# EAGLE design a22 (EAGLE 9.4.2)
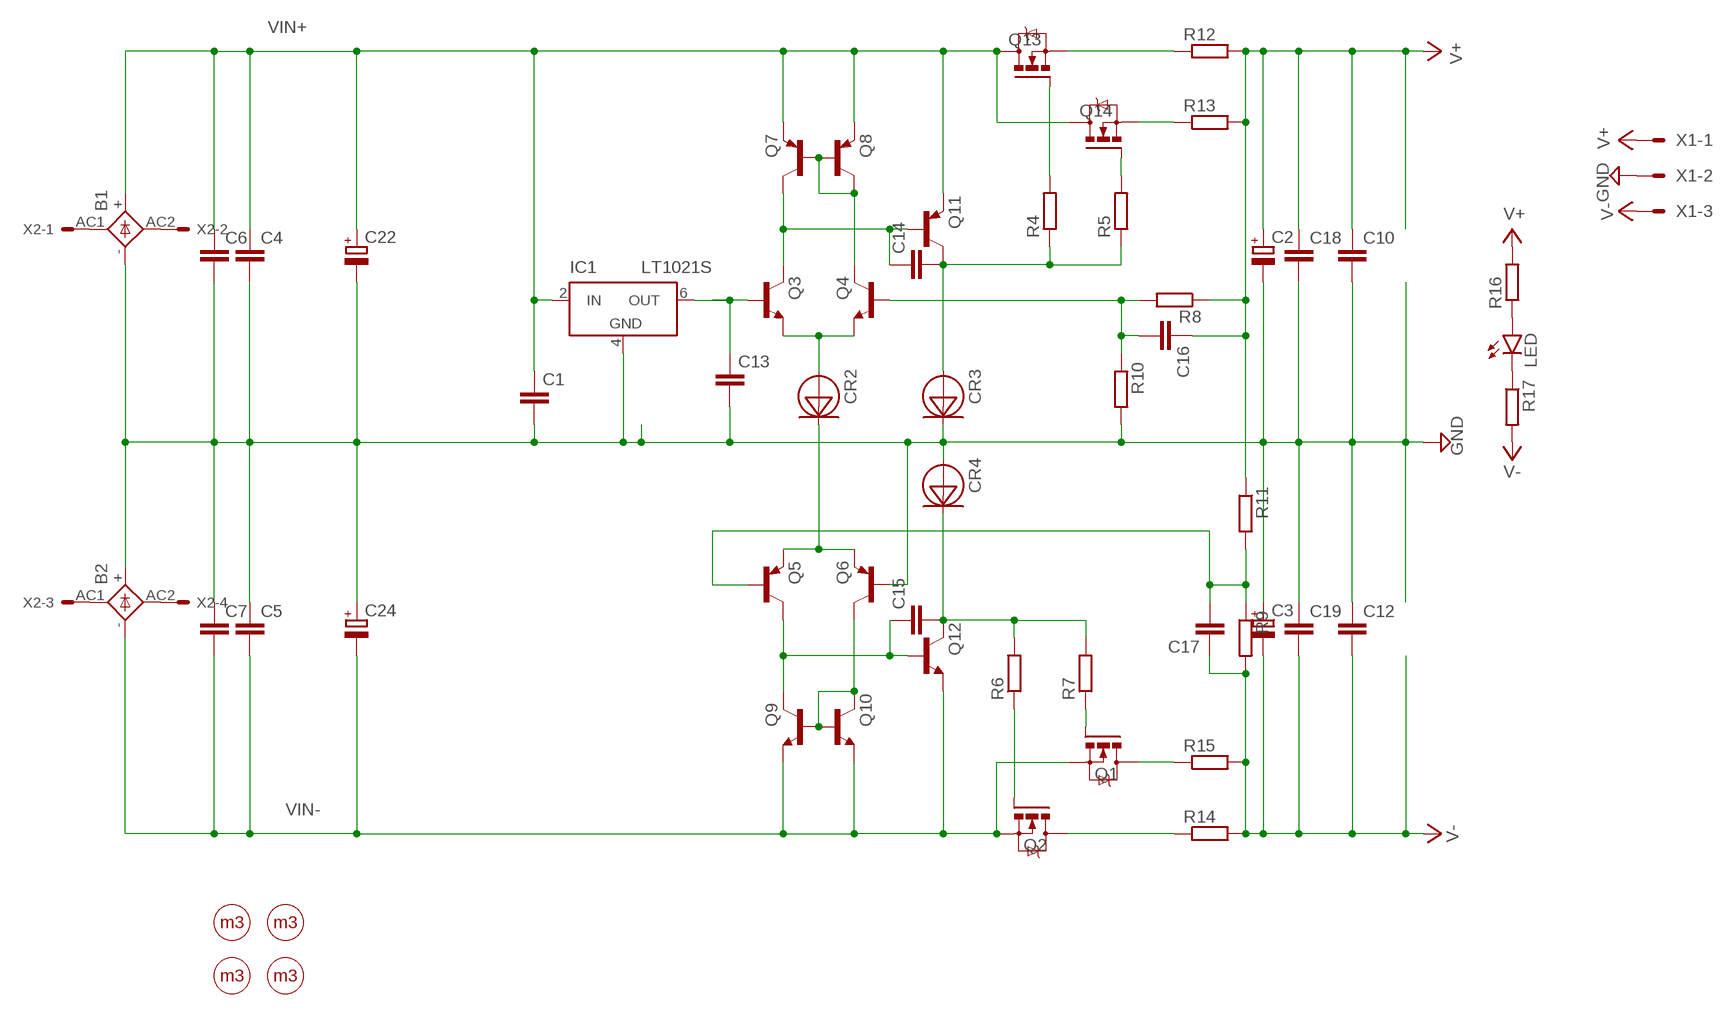
[diagram p0: schematic, sheet 1]

## Parts
B1  2KBB-R  [2KBB-R]
B2  2KBB-R  [2KBB-R]
C1  C-EUC0805  [C0805]
C2  CPOL-EUE5-13  [E5-13]
C3  CPOL-EUE5-13  [E5-13]
C4  C-EU050-050X075  [C050-050X075]
C5  C-EU050-050X075  [C050-050X075]
C6  C-EU050-050X075  [C050-050X075]
C7  C-EU050-050X075  [C050-050X075]
C10  C-EU050-050X075  [C050-050X075]
C12  C-EU050-050X075  [C050-050X075]
C13  C-EUC0805  [C0805]
C14  C-EUC0805  [C0805]
C15  C-EUC0805  [C0805]
C16  C-EUC0805  [C0805]
C17  C-EUC0805  [C0805]
C18  C-EU050-050X075  [C050-050X075]
C19  C-EU050-050X075  [C050-050X075]
C22  CPOL-EUE10-25  [EB25D]
C24  CPOL-EUE10-25  [EB25D]
CR2  1N5283  [SMD]
CR3  1N5283  [SMD]
CR4  1N5283  [SMD]
IC1  LT1021S  [SOIC8]
LED  LEDVWV1206  [LED_SML1206]
Q1  IRFZ24N  [TRANSISTOR_TO220KG]
Q2  IRFZ24N  [TRANSISTOR_TO220KG]
Q3  BJT_NPNKSC1845  [TRANSISTOR_TO92-ECB_N]
Q4  BJT_NPNKSC1845  [TRANSISTOR_TO92-ECB_N]
Q5  BJT_PNPKSA992  [TRANSISTOR_TO92-ECB_P]
Q6  BJT_PNPKSA992  [TRANSISTOR_TO92-ECB_P]
Q7  BJT_PNPKSA992  [TRANSISTOR_TO92-ECB_P]
Q8  BJT_PNPKSA992  [TRANSISTOR_TO92-ECB_P]
Q9  BJT_NPNKSC1845  [TRANSISTOR_TO92-ECB_N]
Q10  BJT_NPNKSC1845  [TRANSISTOR_TO92-ECB_N]
Q11  BJT_PNPKSA992  [TRANSISTOR_TO92-ECB_P]
Q12  BJT_NPNKSC1845  [TRANSISTOR_TO92-ECB_N]
Q13  IRFZ24N  [TRANSISTOR_TO220KG]
Q14  IRFZ24N  [TRANSISTOR_TO220KG]
R4  R-EU_MELF0204W  [MINI_MELF-0204W]
R5  R-EU_MELF0204W  [MINI_MELF-0204W]
R6  R-EU_MELF0204W  [MINI_MELF-0204W]
R7  R-EU_MELF0204W  [MINI_MELF-0204W]
R8  R-EU_MELF0204W  [MINI_MELF-0204W]
R9  R-EU_MELF0204W  [MINI_MELF-0204W]
R10  R-EU_MELF0204W  [MINI_MELF-0204W]
R11  R-EU_MELF0204W  [MINI_MELF-0204W]
R12  R-EU_R2512  [R2512]
R13  R-EU_R2512  [R2512]
R14  R-EU_R2512  [R2512]
R15  R-EU_R2512  [R2512]
R16  R-EU_MELF0204W  [MINI_MELF-0204W]
R17  R-EU_MELF0204W  [MINI_MELF-0204W]
U$1  HOLE  [M3_HOLE]
U$2  HOLE  [M3_HOLE]
U$3  HOLE  [M3_HOLE]
U$4  HOLE  [M3_HOLE]
X1  KK-156-3  [KK-156-3]
X2  KK-156-4  [KK-156-4]

## Nets
GND: B1.- B2.+ C1.2 C2.- C3.+ C4.2 C5.1 C6.2 C7.1 C10.2 C12.1 C13.2 C18.2 C19.1 C22.- C24.+ CR3.CATHODE CR4.ANODE IC1.4(GND) Q6.B R10.2 X1.2
N$1: B1.AC1 X2.1
N$2: B1.AC2 X2.2
N$3: Q1.1(G) R7.1
N$4: Q13.1(G) R4.2
N$5: C17.2 Q5.B R9.1 R11.2
N$6: B2.AC1 X2.3
N$7: B2.AC2 X2.4
N$10: LED.A R16.1
N$13: CR2.CATHODE Q5.E Q6.E
N$14: CR2.ANODE Q3.E Q4.E
N$15: C13.1 IC1.6(OUT) Q3.B
N$16: Q4.C Q7.B Q8.B Q8.C
N$17: Q6.C Q9.B Q10.B Q10.C
N$18: C15.1 Q5.C Q9.C Q12.B
N$21: C14.1 Q3.C Q7.C Q11.B
N$22: C14.2 CR3.ANODE Q11.C R4.1 R5.1
N$23: C15.2 CR4.CATHODE Q12.C R6.2 R7.2
N$24: Q14.1(G) R5.2
N$26: LED.C R17.1
N$27: Q2.1(G) R6.1
N$28: C16.2 Q4.B R8.2 R10.1
N$30: Q1.2(D) R15.1
N$31: Q2.2(D) R14.1
N$33: Q13.3(S) R12.1
N$34: Q14.3(S) R13.1
V+: C2.+ C10.1 C16.1 C18.1 R8.1 R11.1 R12.2 R13.2 R16.2 X1.1
V-: C3.- C12.2 C17.1 C19.2 R9.2 R14.2 R15.2 R17.2 X1.3
VIN+: B1.+ C1.1 C4.1 C6.1 C22.+ IC1.2(IN) Q7.E Q8.E Q11.E Q13.2(D) Q14.2(D)
VIN-: B2.- C5.2 C7.2 C24.- Q1.3(S) Q2.3(S) Q9.E Q10.E Q12.E

## Library data of the parts
B1 B2 = rectifier:2KBB-R: RECTIFIER grid 3 x 5 mm
C1 C4-C7 C10 C12-C19 = Vwvwbg:C-EU: CAPACITOR, European symbol
C2 C3 C22 C24 = Vwvwbg:CPOL-EU: POLARIZED CAPACITOR, European symbol
CR2-CR4 = crd:1N5283: 0.22 mA through 4.23 mA current regulating diode series
IC1 = Vwvwbg:LT1021: Precision Reference Source: http://www.linear.com/pc/downloadDocument.do?navId=H0,C1,C1010,C1603,P1229,D2805; MPN: LT1021DCS8-10#PBF; OC_FARNELL: 1273428; OC_NEWARK: 57M0993
LED = Vwvwbg:LED: LED OSRAM: - CHIPLED LG R971, LG N971, LY N971, LG Q971, LY Q971, LO R971, LY R971 LH N974, LH R974 LS Q976, LO Q976, LY Q976 LO Q996 - Hyper CHIPLED LW Q18S LB Q993, LB Q99A, LB R99A - SideLED LS A670, LO A670, LY A670, LG A670, LP A670 LB A673, LV A673, LT A673, LW A673 LH A674 LY A675 LS A676, LA A676, LO A676, LY A676, LW A676 LS A679, LY A679, LG A679 - Hyper Micro SIDELED® LS Y876, LA Y876, LO Y876, LY Y876 LT Y87S - SmartLED LW L88C, LW L88S LB L89C, LB L89S, LG L890 LS L89K, LO L89K, LY L89K LS L896, LA L896, LO L896, LY L896 - TOPLED LS T670, LO T670, LY T670, LG T670, LP T670 LSG T670, LSP T670, LSY T670, LOP T670, LYG T670 LG T671, LOG T671, LSG T671 LB T673, LV T673, LT T673, LW T673 LH T674 LS T676, LA T676, LO T676, LY T676, LB T676, LH T676, LSB T676, LW T676 LB T67C, LV T67C, LT T67C, LS T67K, LO T67K, LY T67K, LW E67C LS E67B, LA E67B, LO E67B, LY E67B, LB E67C, LV E67C, LT E67C LW T67C LS T679, LY T679, LG T679 LS T770, LO T770, LY T770, LG T770, LP T770 LB T773, LV T773, LT T773, LW T773 LH T774 LS E675, LA E675, LY E675, LS T675 LS T776, LA T776, LO T776, LY T776, LB T776 LHGB T686 LT T68C, LB T68C - Hyper Mini TOPLED® LB M676 - Mini TOPLED Santana® LG M470 LS M47K, LO M47K, LY M47K Source: http://www.osram.convergy.de LUXEON: - LUMILED® LXK2-PW12-R00, LXK2-PW12-S00, LXK2-PW14-U00, LXK2-PW14-V00 LXK2-PM12-R00, LXK2-PM12-S00, LXK2-PM14-U00 LXK2-PE12-Q00, LXK2-PE12-R00, LXK2-PE12-S00, LXK2-PE14-T00, LXK2-PE14-U00 LXK2-PB12-K00, LXK2-PB12-L00, LXK2-PB12-M00, LXK2-PB14-N00, LXK2-PB14-P00, LXK2-PB14-Q00 LXK2-PR12-L00, LXK2-PR12-M00, LXK2-PR14-Q00, LXK2-PR14-R00 LXK2-PD12-Q00, LXK2-PD12-R00, LXK2-PD12-S00 LXK2-PH12-R00, LXK2-PH12-S00 LXK2-PL12-P00, LXK2-PL12-Q00, LXK2-PL12-R00 Source: www.luxeon.com KINGBRIGHT: KA-3528ASYC Source: www.kingbright.com
Q1 Q2 Q13 Q14 = Vwvwbg:IRFZ24N
Q3 Q4 Q9 Q10 Q12 = Vwvwbg:BJT_NPN
Q5-Q8 Q11 = Vwvwbg:BJT_PNP
R4-R17 = Vwvwbg:R-EU_: RESISTOR, European symbol
U$1-U$4 = Vwvwbg:HOLE
X1 = Vwvwbg:KK-156-3: KK 156 HEADER Source: http://www.molex.com/pdm_docs/sd/026604100_sd.pdf; MF: MOLEX; OC_FARNELL: unknown; OC_NEWARK: unknown
X2 = Vwvwbg:KK-156-4: KK 156 HEADER Source: http://www.molex.com/pdm_docs/sd/026604100_sd.pdf; MF: MOLEX; OC_FARNELL: unknown; OC_NEWARK: unknown

## Board
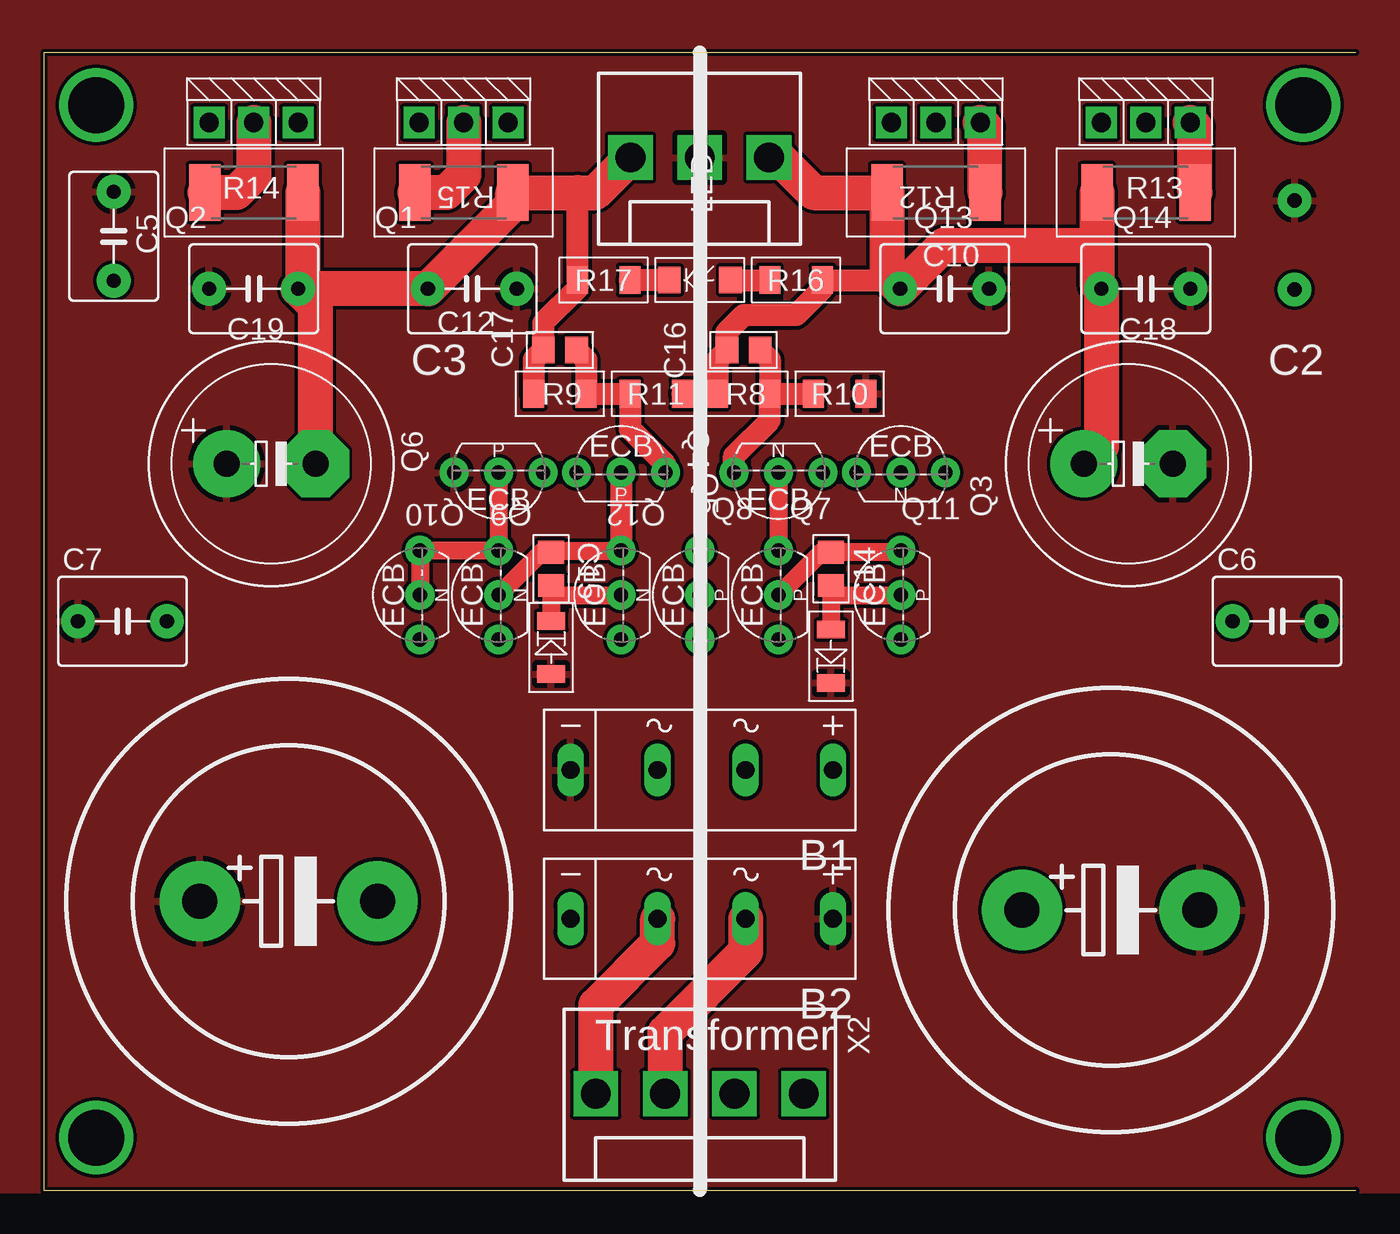
[diagram p1: board, top side]
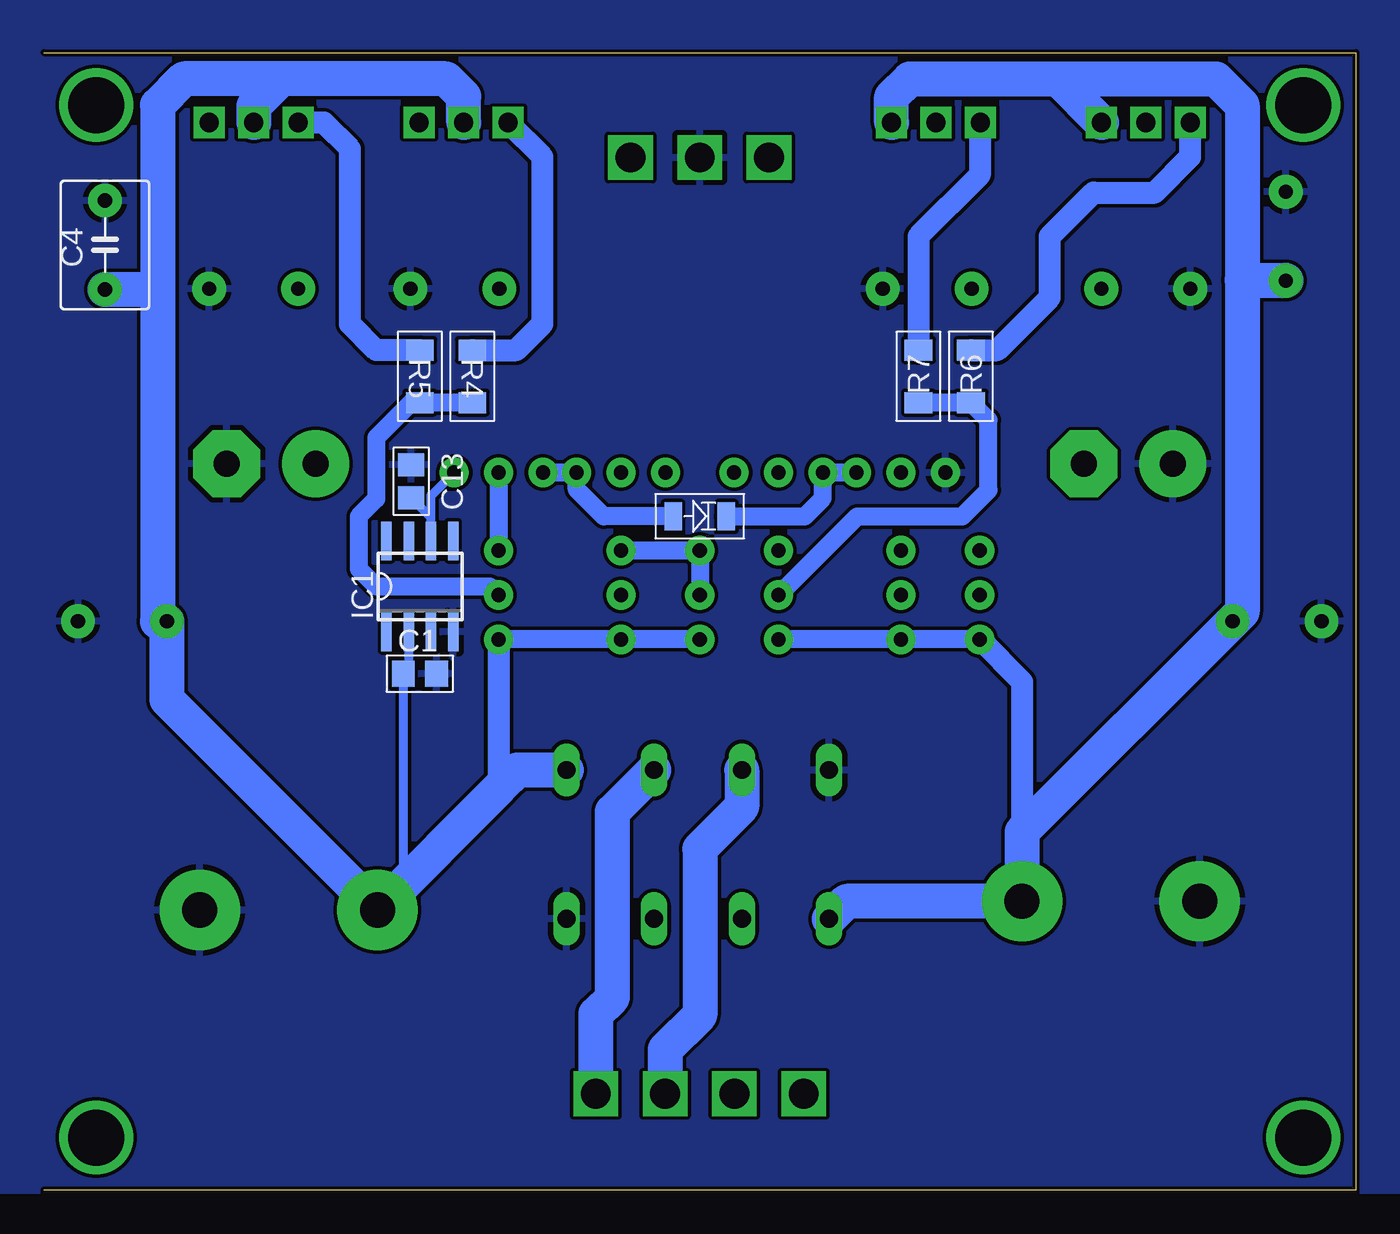
[diagram p2: board, bottom side, seen from below]

Size 75 x 65 mm. Coordinates in mm from the lower left corner, seen from the top.
Outline: 75,0 0,0 0,65 75,65
Copper layers (1*16): Top 0.035mm / dielectric 1.5mm / Bottom 0.035mm
Design rules "default *": minimum track width 10mil, minimum drill 24mil, track to track 8mil, track to pad 8mil, pad to pad 8mil, via to via 8mil, smd to smd 8mil, copper to edge 8mil, drill to drill 8mil, minimum pad ring 10mil, minimum via ring 8mil, stop-mask expansion 4mil, vias tented up to drill 0mil, thermal gap 12mil

### Footprints (pad centres in the part's own frame; a part is rotated, then mirrored left to right if it is on the bottom)
2KBB-R = drill 1.016 long: + -7.62,0; - 7.391,0; AC1 -2.616,0; AC2 2.413,0
C0805 = smd 1.3 x 1.5: 1 -0.95,0; 2 0.95,0
E5-13 = drill 1.5 pad 3.81: + -2.54,0 | drill 1.5 pad 3.81 octagon: - 2.54,0
C050-050X075 = drill 0.813 pad 1.93: 1 -2.54,0; 2 2.54,0
EB25D = drill 2.007 pad 4.597: + -5.08,0; - 5.08,0
SMD = smd 1 x 1.6: ANODE 1.525,0; CATHODE -1.525,0
SOIC8 = smd 0.6 x 2.2: 1 -1.905,-2.6; 2 -0.635,-2.6; 3 0.635,-2.6; 4 1.905,-2.6; 5 1.905,2.6; 6 0.635,2.6; 7 -0.635,2.6; 8 -1.905,2.6
LED_SML1206 = smd 1.3 x 1.5: A 1.75,0; C -1.75,0
TRANSISTOR_TO220KG = drill 1.1 pad 1.778 square: 1 -2.54,0; 2 0,0; 3 2.54,0
TRANSISTOR_TO92-ECB_N = drill 0.813 pad 1.676: B 2.54,0; C 0,0; E -2.54,0
TRANSISTOR_TO92-ECB_P = drill 0.813 pad 1.676: B 2.54,0; C 0,0; E -2.54,0
MINI_MELF-0204W = smd 1.2 x 1.6: 1 -1.5,0; 2 1.5,0
R2512 = smd 1.8 x 3.2: 1 -2.8,0; 2 2.8,0
M3_HOLE = drill 3.2: P$1 0,0
KK-156-3 = drill 1.7 pad 2.54 square: 1 -3.96,0; 2 0,0; 3 3.96,0
KK-156-4 = drill 1.7 pad 2.54 square: 1 -5.94,0; 2 -1.98,0; 3 1.98,0; 4 5.94,0

### Placement (x,y rotation side)
B1  37.5,24 180 top
B2  37.5,15.5 180 top
C1  53.5,29.5 0 bottom
C2  62,41.5 0 top
C3  13,41.5 0 top
C4  71.5,54 90 bottom
C5  4,54.5 270 top
C6  70.5,32.5 0 top
C7  4.5,32.5 0 top
C10  51.5,51.5 0 top
C12  24.5,51.5 180 top
C13  54,40.5 90 bottom
C14  45,35.5 270 top
C15  29,35.5 270 top
C16  40,48 0 top
C17  29.5,48 0 top
C18  63,51.5 0 top
C19  12,51.5 0 top
C22  61,16 0 top
C24  14,16.5 0 top
CR2  37.5,38.5 180 bottom
CR3  45,30.5 90 top
CR4  29,31 270 top
IC1  53.5,34.5 0 bottom
LED  37.5,52 0 top
Q1  24,61 0 top
Q2  12,61 0 top
Q3  49,41 0 top
Q4  42,41 180 top
Q5  33,41 0 top
Q6  26,41 180 top
Q7  42,34 90 top
Q8  37.5,34 90 top
Q9  26,34 90 top
Q10  21.5,34 90 top
Q11  49,34 90 top
Q12  33,34 90 top
Q13  51,61 0 top
Q14  63,61 0 top
R4  50.5,46.5 90 bottom
R5  53.5,46.5 90 bottom
R6  22,46.5 270 bottom
R7  25,46.5 270 bottom
R8  40,45.5 0 top
R9  29.5,45.5 180 top
R10  45.5,45.5 0 top
R11  35,45.5 180 top
R12  51,57 180 top
R13  63,57 180 top
R14  12,57 0 top
R15  24,57 0 top
R16  43,52 0 top
R17  32,52 180 top
U$1  3,3 0 top
U$2  72,3 0 top
U$3  3,62 0 top
U$4  72,62 0 top
X1  37.5,59 180 top
X2  37.5,5.5 180 top

### Tracks (layer width: path | path; a pad name or v marks a point on that pad's centre or on a via)
GND
  pour Bottom: -7.5,72.39 78.85,72.39 78.85,0 -7.5,0
  pour Top: -8.5,72.39 78.85,72.39 78.85,0 -8.5,0
N$1
  Bottom 2: X2.1 43.44,10.06 42.5,11 42.5,21.62 B1.AC1
N$2
  Bottom 2: B1.AC2 35.09,21.91 37.5,19.5 37.5,10 39.48,8.02 X2.2
N$3
  Bottom 1.27: Q1.1 21.5,60.96 21.5,58 25,54.5 R7.1
N$4
  Bottom 1.27: R4.2 48,48 46.5,49.5 46.5,59.04 Q13.1
N$5
  Top 1.27: C17.2 31,47.45 R9.1 R11.2 33.5,43.5 35.54,41.46 Q5.B
N$6
  Top 2: B2.AC1 40.12,13.62 35.5,9 35.5,5.52 X2.3
N$7
  Top 2: X2.4 31.56,10.56 35.09,14.09 B2.AC2
N$10
  Top 1.27: LED.A R16.1
N$13
  Bottom 1.016: CR2.CATHODE 31.5,38.5 30.46,39.54 Q5.E Q6.E
N$14
  Bottom 1.016: CR2.ANODE 43,38.5 44.54,40.04 Q4.E Q3.E
N$15
  Bottom 0.508: C13.1 52.87,38.41 IC1.6 52.87,39.67 Q3.B
N$16
  Top 1.016: Q4.C Q7.B
  Bottom 1.016: Q7.B Q8.B Q8.C
N$17
  Top 1.016: Q6.C Q9.B Q10.B Q10.C
N$18
  Top 1.016: Q9.C 28.45,36.45 C15.1 29.09,36.54 Q12.B
  Top 1.27: Q5.C Q12.B
N$21
  Top 1.016: Q11.B 48.91,36.45 C14.1 44.45,36.45 Q7.C
  Bottom 1.016: Q3.C Q11.B
N$22
  Top 1.016: CR3.ANODE C14.2 45.55,34 Q11.C
  Bottom 1.016: R4.1 R5.1 54,45 56,43 56,39.5 57,38.5 57,35.5 56,34.5 49.5,34.5 Q11.C
N$23
  Top 1.016: CR4.CATHODE C15.2 29.55,34 Q12.C
  Bottom 1.016: Q12.C 28.5,38.5 22.5,38.5 21,40 21,44 R6.2 R7.2
N$24
  Bottom 1.27: Q14.1 59,61 57.5,59.5 57.5,49.5 56,48 R5.2
N$26
  Top 1.27: LED.C R17.1
N$27
  Bottom 1.27: R6.1 20.5,48 17.5,51 17.5,54.5 15,57 11.5,57 9.46,59.04 Q2.1
N$28
  Top 1.27: Q4.B 39.46,41.96 41.5,44 R8.2 | R8.2 R10.1 | C16.2 41.5,47.45 R8.2
N$30
  Top 2: Q1.2 24,58 23,57 R15.1
N$31
  Top 2: Q2.2 12,58 11,57 R14.1
N$33
  Top 2: R12.1 53.8,60.74 Q13.3
N$34
  Top 2: R13.1 65.8,60.74 Q14.3
V+
  Top 1.27: R11.1 R8.1 38.5,47.45 C16.1 39,48.05 39,49 40,50 43,50 44.5,51.5 R16.2 47.94,52 48.2,52.26
  Top 2: R13.2 60.2,54 | 60.2,54 60.2,51.76 C18.1 60.46,42.5 C2.+ | X1.1 42,59 44,57 R12.2 48.2,52.26 C10.1 51.46,54 60.2,54
V-
  Top 1.016: 14.8,51.76 C19.2
  Top 1.27: R9.2 28,47.45 C17.1 28.55,49.55 30.5,51.5 R17.2 30.5,57
  Top 2: C3.- 15.54,50.5 C19.2 C12.2 26.8,56.34 R15.2 30.5,57 31.54,57 X1.3 | R14.2 14.8,51.76
VIN+
  Bottom 0.508: IC1.2 54.13,29.82 C1.1 54.45,17.47 C22.+
  Bottom 1.016: Q8.E Q7.E Q11.E
  Bottom 1.27: Q11.E 49,23 48.96,22.96
  Bottom 2: Q13.2 51,62.5 52,63.5 61.44,63.5 | 61.44,63.5 63,61.94 Q14.2 | 61.44,63.5 67,63.5 68.5,62 68.5,51 | 68.5,51 68.5,32.5 C6.1 67.96,28.04 C22.+ 48.96,22.96 47.92,24 B1.+ | C4.1 68.96,51.46 68.5,51
VIN-
  Bottom 1.016: Q12.E Q9.E Q10.E
  Bottom 1.27: Q10.E 19.08,29.04 19.08,20.46
  Bottom 2: Q1.3 26.54,62.46 25.5,63.5 17.04,63.5 | Q2.3 17.04,63.5 | 17.04,63.5 8,63.5 6.5,62 6.5,52 | 6.5,52 6.5,33.04 C7.2 19.08,20.46 C24.- 29.11,16.5 B2.- | C5.2 6.46,51.96 6.5,52

### Text on the board
tPlace: Transformer